# EAGLE design High Current Supply (EAGLE 7.7.0)
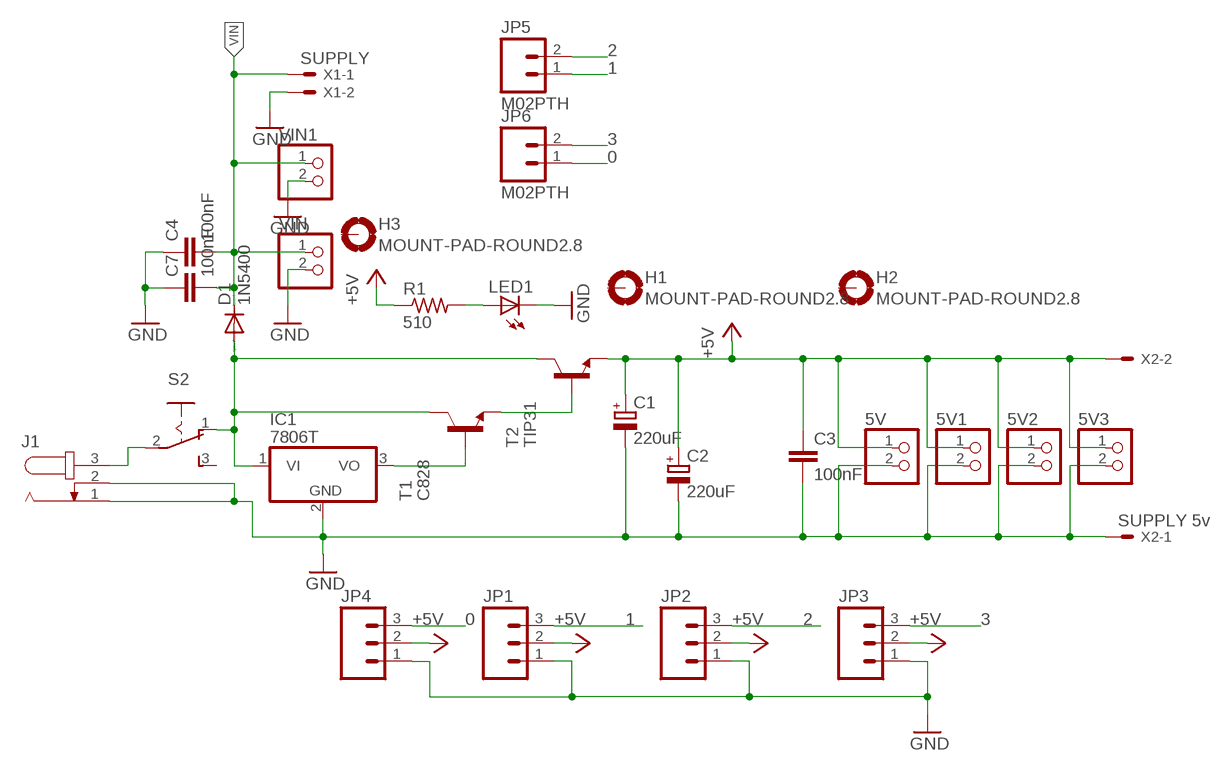
[diagram p0: schematic, sheet 1]

## Parts
5V  PINHD-1X2  [1X02]
5V1  PINHD-1X2  [1X02]
5V2  PINHD-1X2  [1X02]
5V3  PINHD-1X2  [1X02]
C1  220uF  CPOL-EUE2.5-7  [E2,5-7]
C2  220uF  CPOL-EUE2.5-7  [E2,5-7]
C3  100nF  C5/3  [C5B3]
C4  100nF  C5/3  [C5B3]
C7  100nF  C5/3  [C5B3]
D1  1N5400  [DO201-15]
H1  MOUNT-PAD-ROUND2.8  [2,8-PAD]
H2  MOUNT-PAD-ROUND2.8  [2,8-PAD]
H3  MOUNT-PAD-ROUND2.8  [2,8-PAD]
IC1  7806T  [TO220H]
J1  JACK-PLUG1  [SPC4078]
JP1  M03PTH  [1X03]
JP2  M03PTH  [1X03]
JP3  M03PTH  [1X03]
JP4  M03PTH  [1X03]
JP5  M02PTH  [1X02]
JP6  M02PTH  [1X02]
LED1  LED3MM  [LED3MM]
R1  510  R-US_R0603  [R0603]
S2  255SB  [255SB]
T1  C828  2SC945  [TO92-ECB]
T2  TIP31  [TO220]
VIN  PINHD-1X2  [1X02]
VIN1  PINHD-1X2  [1X02]
X1  SUPPLY  JST-XH-02-PIN-LONG-PAD  [JST-XH-02-PACKAGE-LONG-PAD]
X2  SUPPLY 5v  JST-XH-02-PIN-LONG-PAD  [JST-XH-02-PACKAGE-LONG-PAD]

## Nets
0: JP4.3 JP6.1
1: JP1.3 JP5.1
2: JP2.3 JP5.2
3: JP3.3 JP6.2
+5V: 5V1.1 5V2.1 5V3.1 5V.1 C1.+ C2.+ C3.1 JP1.2 JP2.2 JP3.2 JP4.2 R1.1 T2.3(E) X2.2
GND: 5V1.2 5V2.2 5V3.2 5V.2 C1.- C2.- C3.2 C4.1 C7.1 IC1.2(GND) J1.1 J1.2 JP1.1 JP2.1 JP3.1 JP4.1 LED1.K(C) VIN1.2 VIN.2 X1.2 X2.1
N$1: T1.E T2.1(B)
N$2: J1.3 S2.2(P)
N$3: IC1.3(VO) T1.B
N$4: D1.A IC1.1(VI) S2.1(O) T1.C T2.2(C)
N$5: LED1.A R1.2
VIN: C4.2 C7.2 D1.C VIN1.1 VIN.1 X1.1
Unconnected: H1.B2,8(MOUNT) H2.B2,8(MOUNT) H3.B2,8(MOUNT) S2.3(S)

## Library data of the parts
5V 5V1-5V3 VIN VIN1 = pinhead:PINHD-1X2: PIN HEADER
C1 C2 = resistor:CPOL-EU: POLARIZED CAPACITOR, European symbol
C3 C4 C7 = capacitor-wima:C: CAPACITOR naming: grid - package width
D1 = diode:1N5400: DIODE standard rectifier, 3 A, 50 V (Motorola)
H1-H3 = holes:MOUNT-PAD-ROUND: MOUNTING PAD, round
IC1 = linear:78*: Positive VOLTAGE REGULATOR Source: http://cache.national.com/ds/LM/LM78L05.pdf http://www.fairchildsemi.com/ds/LM/LM7805.pdf
J1 = con-jack:JACK-PLUG: DC POWER JACK Power Jack, DC, Right Angle, Through Hole, Rated 5A at 16VDC, PC Terminals Distributor: Farnell (www.Farnell.de) Drawing: 84N1161.pdf / 84N1162.pdf Manufacturer: SPC Technology (www.spctechnology.com) Type: SPC4077 / SPC 4078; OC_FARNELL: unknown; OC_NEWARK: unknown
JP1-JP4 = SparkFun-Connectors:M03: Header 3 Standard 3-pin 0.1" header. Use with straight break away headers (SKU : PRT-00116), right angle break away headers (PRT-00553), swiss pins (PRT-00743), machine pins (PRT-00117), and female headers (PRT-00115). Molex polarized connector foot print use with SKU : PRT-08232 with associated crimp pins and housings.
JP5 JP6 = SparkFun-Connectors:M02: Standard 2-pin 0.1" header. Use with - straight break away headers ( PRT-00116) - right angle break away headers (PRT-00553) - swiss pins (PRT-00743) - machine pins (PRT-00117) - female headers (PRT-00115) Molex polarized connector foot print use with: PRT-08233 with associated crimp pins and housings. 2.54_SCREWTERM for use with PRT-10571. 3.5mm Screw Terminal footprints for PRT-08084 5mm Screw Terminal footprints for use with PRT-08432
LED1 = CircuitBean:LED: LED OSRAM: - CHIPLED LG R971, LG N971, LY N971, LG Q971, LY Q971, LO R971, LY R971 LH N974, LH R974 LS Q976, LO Q976, LY Q976 LO Q996 - Hyper CHIPLED LW Q18S LB Q993, LB Q99A, LB R99A - SideLED LS A670, LO A670, LY A670, LG A670, LP A670 LB A673, LV A673, LT A673, LW A673 LH A674 LY A675 LS A676, LA A676, LO A676, LY A676, LW A676 LS A679, LY A679, LG A679 - Hyper Micro SIDELED® LS Y876, LA Y876, LO Y876, LY Y876 LT Y87S - SmartLED LW L88C, LW L88S LB L89C, LB L89S, LG L890 LS L89K, LO L89K, LY L89K LS L896, LA L896, LO L896, LY L896 - TOPLED LS T670, LO T670, LY T670, LG T670, LP T670 LSG T670, LSP T670, LSY T670, LOP T670, LYG T670 LG T671, LOG T671, LSG T671 LB T673, LV T673, LT T673, LW T673 LH T674 LS T676, LA T676, LO T676, LY T676, LB T676, LH T676, LSB T676, LW T676 LB T67C, LV T67C, LT T67C, LS T67K, LO T67K, LY T67K, LW E67C LS E67B, LA E67B, LO E67B, LY E67B, LB E67C, LV E67C, LT E67C LW T67C LS T679, LY T679, LG T679 LS T770, LO T770, LY T770, LG T770, LP T770 LB T773, LV T773, LT T773, LW T773 LH T774 LS E675, LA E675, LY E675, LS T675 LS T776, LA T776, LO T776, LY T776, LB T776 LHGB T686 LT T68C, LB T68C - Hyper Mini TOPLED® LB M676 - Mini TOPLED Santana® LG M470 LS M47K, LO M47K, LY M47K Source: http://www.osram.convergy.de/
R1 = CircuitBean:R-US_: RESISTOR, American symbol
S2 = switch:255SB: SLIDING SWITCH Distributor Buerklin, 11G810
T1 = transistor:2SC945: NPN Silicon Epitaxial Planar Transistor Source: SEMTECH ELECTRONICS LTD. ... 2SC945 2.pdf
T2 = transistor:TIP31: NPN Transistor Medium Power Linear Switching Applications Source: http://onsemi.com
X1 X2 = JST XH Connectors v1-0:JST-XH-02-PIN: JST XH Connector 2 Pin Wire to board connector. Pitch: 2,54 mm, (0.100") Number of pins: 2 Created by Rembrandt Electronics www.rembrandtelectronics.com

## Board
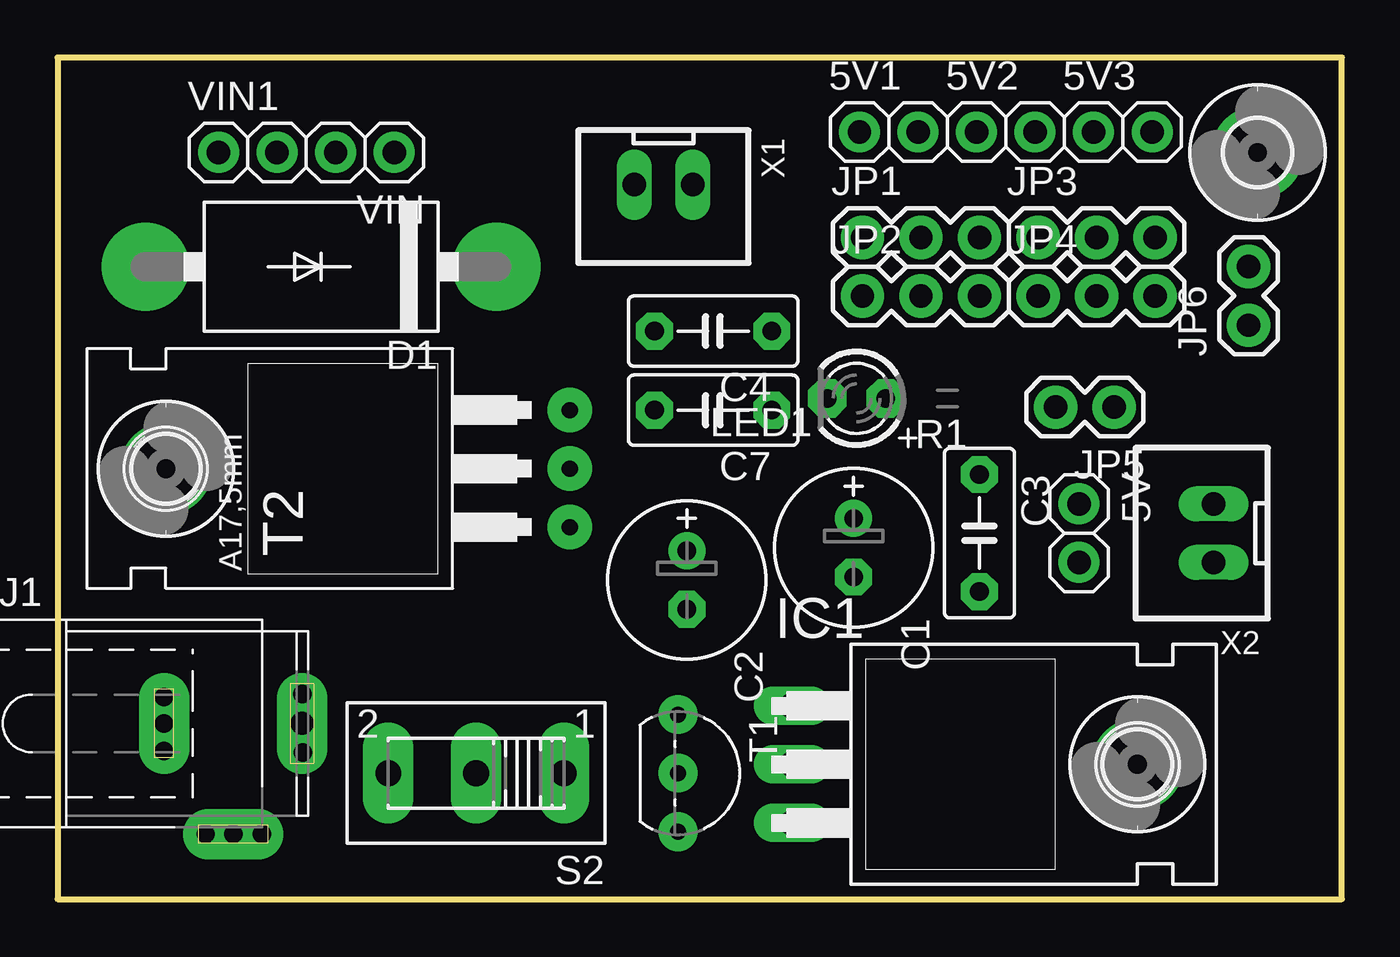
[diagram p1: board, top side]
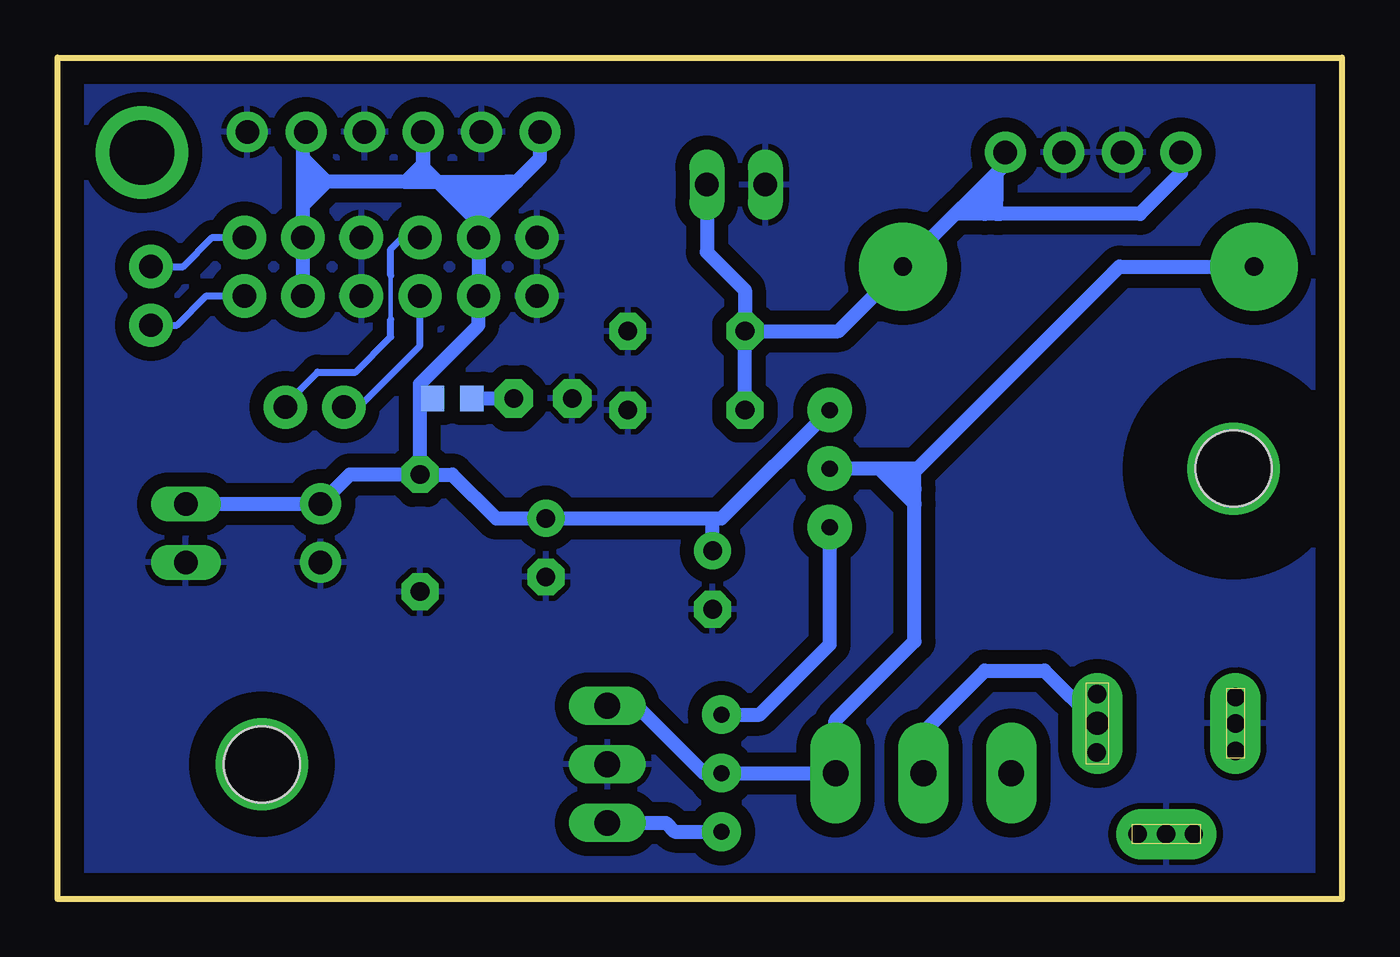
[diagram p2: board, bottom side, seen from below]

Size 55.73 x 36.5 mm. Coordinates in mm from the lower left corner, seen from the top.
Outline: 0,0 55.73,0 55.73,36.5 0,36.5 0,0
Copper layers (1*16): Top 0.035mm / dielectric 1.5mm / Bottom 0.035mm
Design rules "default": minimum track width 10mil, minimum drill 24mil, track to track 8mil, track to pad 8mil, pad to pad 8mil, via to via 8mil, smd to smd 8mil, copper to edge 40mil, drill to drill 8mil, minimum pad ring 10mil, minimum via ring 8mil, stop-mask expansion 4mil, vias tented up to drill 0mil, thermal gap 10mil

### Footprints (pad centres in the part's own frame; a part is rotated, then mirrored left to right if it is on the bottom)
1X02 = drill 1.016 pad 1.778: 1 -1.27,0; 2 1.27,0
E2,5-7 = drill 0.813 pad 1.6: + -1.27,0 | drill 0.813 pad 1.6 octagon: - 1.27,0
C5B3 = drill 0.813 pad 1.6 octagon: 1 -2.54,0; 2 2.54,0
DO201-15 = drill 0.8 pad 3.81: A 7.62,0; C -7.62,0
2,8-PAD = drill 2.8 pad 4: B2,8 0,0
TO220H = drill 1.118 long: 1 -2.54,-10.16; 2 0,-10.16; 3 2.54,-10.16 | hole 3.302: 0,4.826
SPC4078 = drill 0.8 pad 2.184 long: 1 -3,0; 2 0,-4.8 | drill 1 pad 2.184 long: 3 3,0 | drill 0.8: P$1 -2.997,1.143; P$2 -2.997,-1.194; P$3 2.997,1.27; P$4 3.023,-1.27; P$5 -1.194,-4.801; P$6 1.245,-4.801
1X03 = drill 1.016 pad 1.88: 1 0,0; 2 2.54,0; 3 5.08,0
1X02' = drill 1.016 pad 1.88: 1 0,0; 2 2.54,0
LED3MM = drill 0.813 pad 1.676 octagon: A -1.27,0; K 1.27,0
R0603 = smd 1 x 1.1 bottom: 1 -0.85,0; 2 0.85,0
255SB = drill 1.118 pad 2.184 long: 1 -3.81,0; 2 0,0; 3 3.81,0
TO92-ECB = drill 0.7 pad 1.676: B 2.54,0; C 0,0; E -2.54,0
TO220 = drill 0.7 pad 1.93: 1 -2.54,-6.35; 2 0,-6.35; 3 2.54,-6.35 | hole 3.302: 0,11.176
JST-XH-02-PACKAGE-LONG-PAD = drill 1.016 long: 1 -1.27,0; 2 1.27,0

### Placement (x,y rotation side)
5V  44.32,15.88 270 top
5V1  36.07,33.27 0 top
5V2  41.15,33.27 0 top
5V3  46.23,33.27 0 top
C1  34.54,15.24 270 top
C2  27.3,13.84 270 top
C3  40.01,15.88 270 top
C4  28.45,24.64 180 top
C7  28.45,21.21 180 top
D1  11.43,27.43 180 top
H1  52.07,32.38 0 top
H2  4.7,18.67 0 top
H3  46.86,5.84 0 top
IC1  42.04,5.84 270 top
J1  7.62,7.62 0 top
JP1  34.92,28.7 0 top
JP2  34.92,26.16 0 top
JP3  42.55,28.7 0 top
JP4  42.55,26.16 0 top
JP5  M02PTH  [1X02']  45.85,21.34 180 top
JP6  M02PTH  [1X02']  51.69,24.89 90 top
LED1  34.67,21.72 180 top
R1  38.61,21.72 180 top
S2  18.16,5.46 180 top
T1  26.92,5.46 270 top
T2  15.88,18.67 90 top
VIN  13.34,32.38 180 top
VIN1  8.26,32.38 0 top
X1  26.29,30.99 180 top
X2  50.16,15.88 90 top

### Tracks (layer width: path | path; a pad name or v marks a point on that pad's centre or on a via)
0
  Bottom 0.305: JP6.1 50.55,24.89 49.28,26.16 JP4.3
1
  Bottom 0.203: 41.27,25.15 41.27,27.05
  Bottom 0.305: JP1.3 40.77,28.7 41.15,28.32 41.27,28.19 41.27,27.05 | JP5.1 45.85,21.46 44.45,22.86 42.8,22.86 41.27,24.38 41.27,25.15
2
  Bottom 0.305: JP2.3 40.01,24 42.67,21.34 JP5.2
3
  Bottom 0.305: JP6.2 50.29,27.43 49.02,28.7 JP3.3
+5V
  Bottom 0.61: C3.1 43.05,18.41 5V.1 X2.2 | JP4.2 JP3.2 45.09,30.99 | 45.09,30.99 45.09,32.13 | 45.09,32.13 45.09,33.15 5V3.1 | 37.47,29.34 JP1.2 JP2.2 37.47,24.89 40.01,22.35 40.01,21.84 | 37.47,29.34 39.24,31.11 | 39.24,31.11 39.88,31.75 5V2.1 39.88,31.88 40.64,31.11 | 37.47,29.34 37.47,29.46 35.81,31.11 | 35.81,31.11 34.8,32.13 5V1.1 | 40.64,31.11 44.07,31.11 | 44.07,31.11 44.96,31.11 45.09,30.99 | 27.3,16.51 C1.+ 36.7,16.51 38.61,18.41 C3.1 | 27.3,16.51 26.92,16.51 T2.3 | C2.+ 27.3,16.51 | C3.1 40.01,21.84 | R1.1 39.88,21.72 40.01,21.84 | 40.64,31.11 39.24,31.11 | 45.09,32.13 44.07,31.11 | 44.07,31.11 44.96,30.23 | 39.24,31.11 36.32,31.11 | 35.81,31.11 36.32,31.11 | 36.32,31.11 37.47,29.97 37.59,29.97 38.35,30.73 37.21,30.73 | 37.08,30.73 37.21,30.73 | 37.21,30.73 37.59,30.35
GND
  pour Bottom (isolate 0.61): 0,0 55.75,0 55.75,36.45 0,36.45
N$1
  Bottom 0.61: T1.E 25.27,8 22.23,11.05 T2.1
N$2
  Bottom 0.61: S2.2 18.16,7.24 15.49,9.91 12.91,9.91 J1.3
N$3
  Bottom 0.61: IC1.3 29.34,3.3 28.96,2.92 T1.B
N$4
  Bottom 0.61: IC1.1 30.61,8.38 27.69,5.46 T1.C S2.1 21.97,7.75 18.54,11.18 18.54,17.14 | 18.54,17.78 18.54,18.67 | 18.54,18.67 20.07,18.67 | 20.07,18.67 T2.2 | 18.54,18.67 18.41,18.67 9.65,27.43 D1.A | 20.07,18.67 18.54,17.14 | 18.54,17.14 18.54,17.78 | 18.54,17.78 19.18,18.41
N$5
  Bottom 0.61: R1.2 LED1.A
N$14
  pour Bottom (isolate 0.61): 0,0 55.75,0 55.75,36.45 0,36.45
VIN
  Bottom 0.61: X1.1 27.56,28.07 25.91,26.42 C4.2 | C7.2 C4.2 | C4.2 21.84,24.64 D1.C 16.76,29.72 | VIN.1 14.61,31.88 16.13,30.35 | 16.13,30.35 16.76,29.72 | VIN1.1 6.99,31.5 8.76,29.72 14.86,29.72 | 14.86,29.72 14.99,29.72 | 14.99,29.72 15.49,29.72 | 15.49,29.72 16.13,30.35 | 15.49,29.72 16.76,29.72 | 15.75,30.61 14.86,29.72 | 14.99,31.37 14.99,30.35 | 14.99,29.72 14.99,30.35 | 14.99,30.35 15.37,30.73

### Text on the board
tDocu: 5V | * | 5V | * | 5V | * | By MoKami Circuit | * | Vin | V | V | + | - | Supply 5V 1A High Current